# EasyEDA schematic wifi-ra02.json
TITLE: Sheet_1; REV: 1.0; Date: 2022-10-16; Sheet: 1/1; Drawn By: consolomets; Company: Your Company
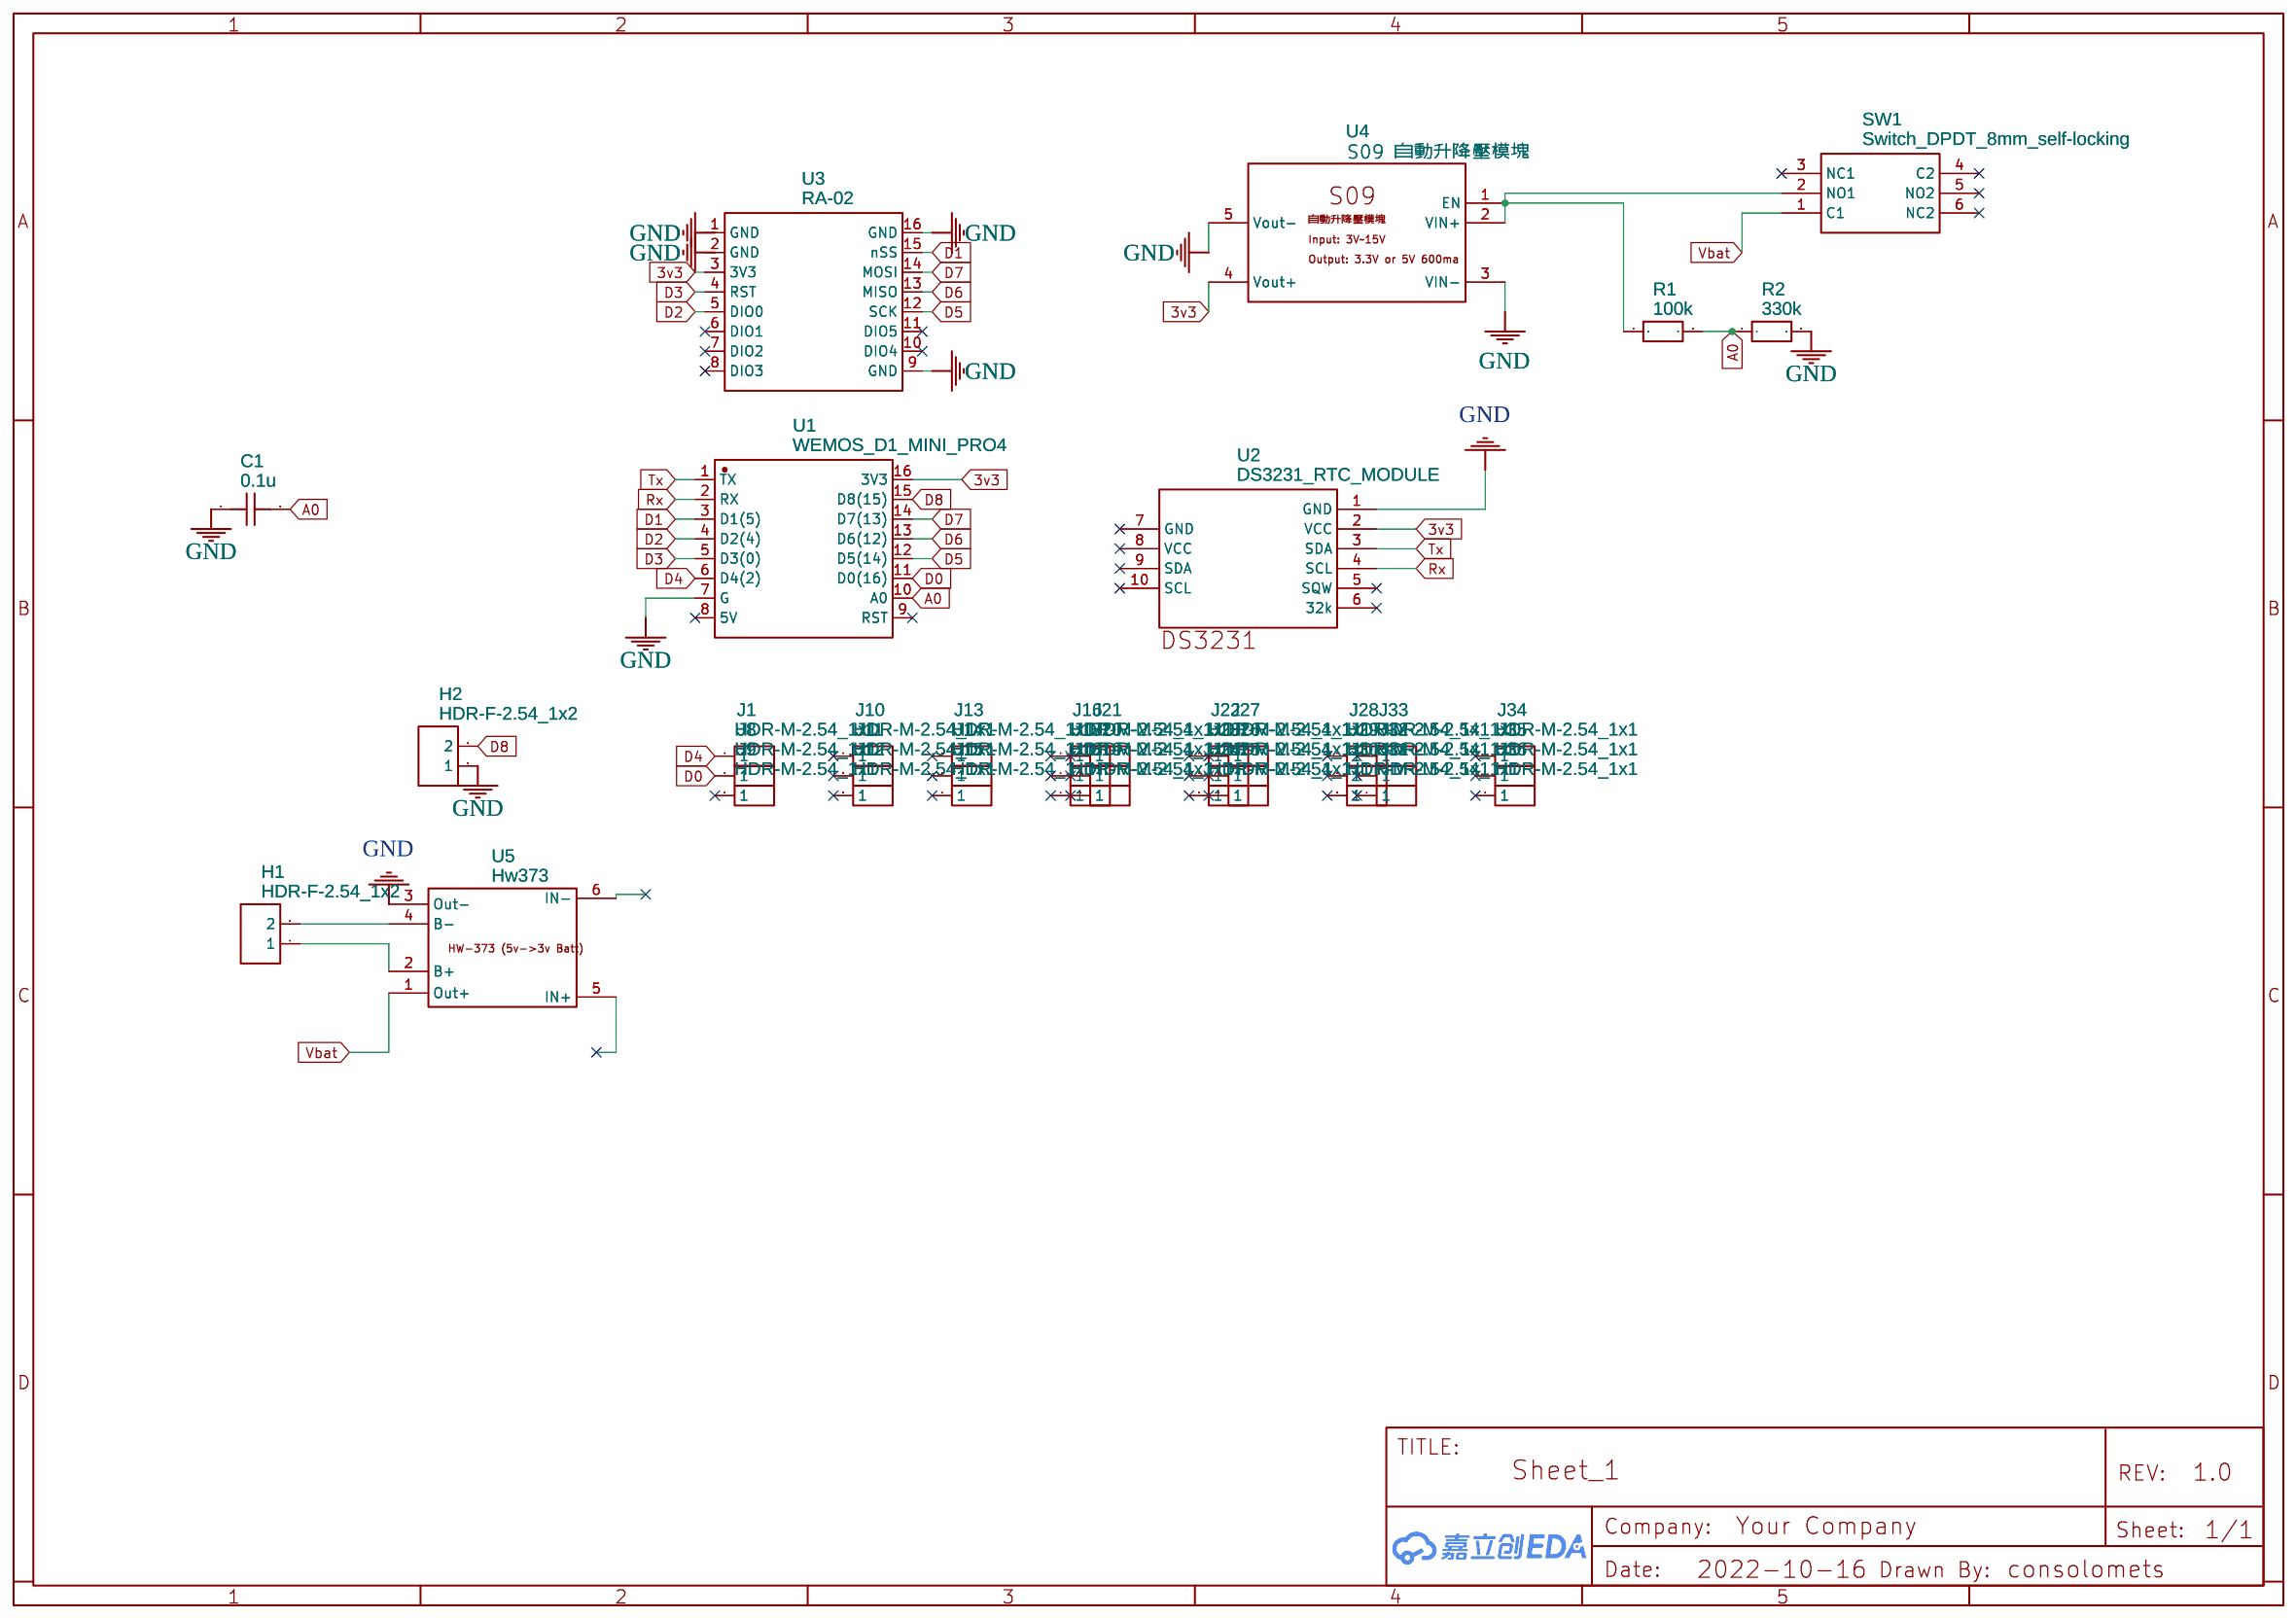
[diagram p0: schematic sheet]

## Parts
C1  0.1u  [C0603]
H1  HDR-F-2.54_1x2  [HDR-F-2.54_1X2]
H2  HDR-F-2.54_1x2  [HDR-F-2.54_1X2]
J1  HDR-M-2.54_1x1  [HDR-M-2.54_1X1]
J8  HDR-M-2.54_1x1  [HDR-M-2.54_1X1]
J9  HDR-M-2.54_1x1  [HDR-M-2.54_1X1]
J10  HDR-M-2.54_1x1  [HDR-M-2.54_1X1]
J11  HDR-M-2.54_1x1  [HDR-M-2.54_1X1]
J12  HDR-M-2.54_1x1  [HDR-M-2.54_1X1]
J13  HDR-M-2.54_1x1  [HDR-M-2.54_1X1]
J14  HDR-M-2.54_1x1  [HDR-M-2.54_1X1]
J15  HDR-M-2.54_1x1  [HDR-M-2.54_1X1]
J16  HDR-M-2.54_1x1  [HDR-M-2.54_1X1]
J17  HDR-M-2.54_1x1  [HDR-M-2.54_1X1]
J18  HDR-M-2.54_1x1  [HDR-M-2.54_1X1]
J19  HDR-M-2.54_1x1  [HDR-M-2.54_1X1]
J20  HDR-M-2.54_1x1  [HDR-M-2.54_1X1]
J21  HDR-M-2.54_1x1  [HDR-M-2.54_1X1]
J22  HDR-M-2.54_1x1  [HDR-M-2.54_1X1]
J23  HDR-M-2.54_1x1  [HDR-M-2.54_1X1]
J24  HDR-M-2.54_1x1  [HDR-M-2.54_1X1]
J25  HDR-M-2.54_1x1  [HDR-M-2.54_1X1]
J26  HDR-M-2.54_1x1  [HDR-M-2.54_1X1]
J27  HDR-M-2.54_1x1  [HDR-M-2.54_1X1]
J28  HDR-M-2.54_1x1  [HDR-M-2.54_1X1]
J29  HDR-M-2.54_1x1  [HDR-M-2.54_1X1]
J30  HDR-M-2.54_1x1  [HDR-M-2.54_1X1]
J31  HDR-M-2.54_1x1  [HDR-M-2.54_1X1]
J32  HDR-M-2.54_1x1  [HDR-M-2.54_1X1]
J33  HDR-M-2.54_1x1  [HDR-M-2.54_1X1]
J34  HDR-M-2.54_1x1  [HDR-M-2.54_1X1]
J35  HDR-M-2.54_1x1  [HDR-M-2.54_1X1]
J36  HDR-M-2.54_1x1  [HDR-M-2.54_1X1]
R1  100k  [R0603]
R2  330k  [R0603]
SW1  Switch_DPDT_8mm_self-locking  [SWITCH SELF LOCKING 8MM TH]
U1  WEMOS_D1_MINI_PRO4  [DIP-16_WEMOS_D1_MINI_PRO4]
U2  DS3231_RTC_MODULE  [DS3231]
U3  RA-02  [RA-02]
U4  S09 自動升降壓模塊  [S09自動升降壓模塊]
U5  Hw373  [HW-373]

## Library data of the parts
C1 = C_0603_US: Contributor: LCEDA_Lib
H1 H2 = HDR-F-2.54_1x2: Supplier Part: C49661; Supplier: LCSC; Contributor: LCEDA_Lib
J1 J8-J36 = HDR-M-2.54_1x1: Supplier Part: C81276; Supplier: LCSC; Contributor: LCEDA_Lib
R1 R2 = R_0603_EU: Contributor: LCEDA_Lib
SW1 = Switch_DPDT_8mm_self-locking: Contributor: Wittaya
U1 = WEMOS_D1_MINI_PRO4: Supplier: LCSC; Supplier Part: C2837266; Manufacturer: null; Manufacturer Part: Wemos_D1_mini_Pro4; Contributor: LCSC; JLCPCB Part Class: Extended Part
U2 = DS3231_RTC_MODULE: Contributor: Ronok Arya
U3 = RA-02: Contributor: dlahoz31
U4 = S09 自動升降壓模塊: Manufacturer: Unknown; Manufacturer Part: S09; link: https://item.taobao.com/item.htm?_u=t61sqhh6f44&id=644654735719; Contributor: rayfighter
U5 = Hw373: Manufacturer: Shenzhen Hairuixing Technology Co., Ltd.; Supplier: alibaba; link: https://arduino.en.alibaba.com/product/62560363653-813084145/HW_373_1A_lithium_battery_charging_board_module_new_TYPE_C_USB_interface_charging_protection_two_in_one.html; Contributor: Met4raptor

## Nets
3v3: U1.16(3V3) U2.2(VCC) U3.3(3V3) U4.4(Vout+)
GND: C1.1 H2.1 R2.2 U1.7(G) U2.1(GND) U3.1(GND) U3.2(GND) U3.9(GND) U3.16(GND) U4.3(VIN-) U4.5(Vout-) U5.3(Out-)
Vbat: SW1.1(C1) U5.1(Out+)
A0: C1.2 R1.2 R2.1 U1.10(A0)
D0: J8.1 U1.11(D0(16))
D1: U1.3(D1(5)) U3.15(nSS)
D2: U1.4(D2(4)) U3.5(DIO0)
D3: U1.5(D3(0)) U3.4(RST)
D4: J1.1 U1.6(D4(2))
D5: U1.12(D5(14)) U3.12(SCK)
D6: U1.13(D6(12)) U3.13(MISO)
D7: U1.14(D7(13)) U3.14(MOSI)
D8: H2.2 U1.15(D8(15))
Rx: U1.2(RX) U2.4(SCL)
Tx: U1.1(TX) U2.3(SDA)
Net-(H1-1): H1.1 U5.2(B+)
Net-(H1-2): H1.2 U5.4(B-)
Net-(R1-1): R1.1 SW1.2(NO1) U4.1(EN) U4.2(VIN+)

Not connected (* = marked no-connect by the designer): J9 1*; J10 1*; J11 1*; J12 1*; J13 1*; J14 1*; J15 1*; J16 1*; J17 1*; J18 1*; J19 1*; J20 1*; J21 1*; J22 1*; J23 1*; J24 1*; J25 1*; J26 1*; J27 1*; J28 1*; J29 1*; J30 1*; J31 1*; J32 1*; J33 1*; J34 1*; J35 1*; J36 1*; SW1 3(NC1)* 4(C2)* 5(NO2)* 6(NC2)*; U1 8(5V)* 9(RST)*; U2 5(SQW)* 6(32k)* 7(GND)* 8(VCC)* 9(SDA)* 10(SCL)*; U3 6(DIO1)* 7(DIO2)* 8(DIO3)* 10(DIO4)* 11(DIO5)*; U5 5(IN+) 6(IN-)
